# Vivado block design system, xczu9eg-ffvb1156-2-e, Vivado 2018.3
# (continued, part 2 of 3)
current_bd_instance /rx_fir_decimator

# ---- hierarchy /axi_adrv9009_rx_os_jesd ----
current_bd_instance /axi_adrv9009_rx_os_jesd
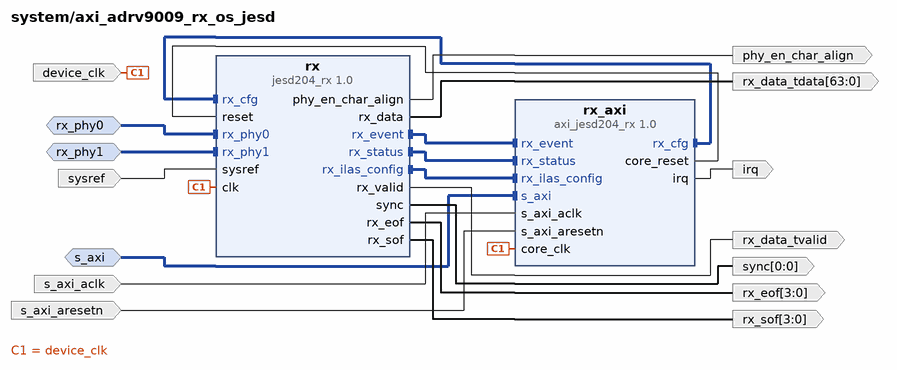
[diagram p11: block diagram inside /axi_adrv9009_rx_os_jesd]
create_bd_intf_pin -mode Slave -vlnv xilinx.com:interface:aximm_rtl:1.0 s_axi
create_bd_intf_pin -mode Slave -vlnv xilinx.com:display_jesd204:jesd204_rx_bus_rtl:1.0 rx_phy0
create_bd_intf_pin -mode Slave -vlnv xilinx.com:display_jesd204:jesd204_rx_bus_rtl:1.0 rx_phy1
create_bd_pin -dir I -type clk s_axi_aclk
create_bd_pin -dir I -type rst s_axi_aresetn
create_bd_pin -dir O -type intr irq
create_bd_pin -dir I -type clk device_clk
create_bd_pin -dir O -from 0 -to 0 sync
create_bd_pin -dir I sysref
create_bd_pin -dir O phy_en_char_align
create_bd_pin -dir O -from 3 -to 0 rx_eof
create_bd_pin -dir O -from 3 -to 0 rx_sof
create_bd_pin -dir O rx_data_tvalid
create_bd_pin -dir O -from 63 -to 0 rx_data_tdata

create_bd_cell -type ip -vlnv analog.com:user:axi_jesd204_rx:1.0 rx_axi
set_property -dict {CONFIG.NUM_LANES 2 CONFIG.NUM_LINKS 1} [get_bd_cells rx_axi]
create_bd_cell -type ip -vlnv analog.com:user:jesd204_rx:1.0 rx
set_property -dict {CONFIG.NUM_LANES 2 CONFIG.NUM_LINKS 1} [get_bd_cells rx]

# ---- hierarchy /rx_os_adrv9009_tpl_core ----
current_bd_instance /rx_os_adrv9009_tpl_core
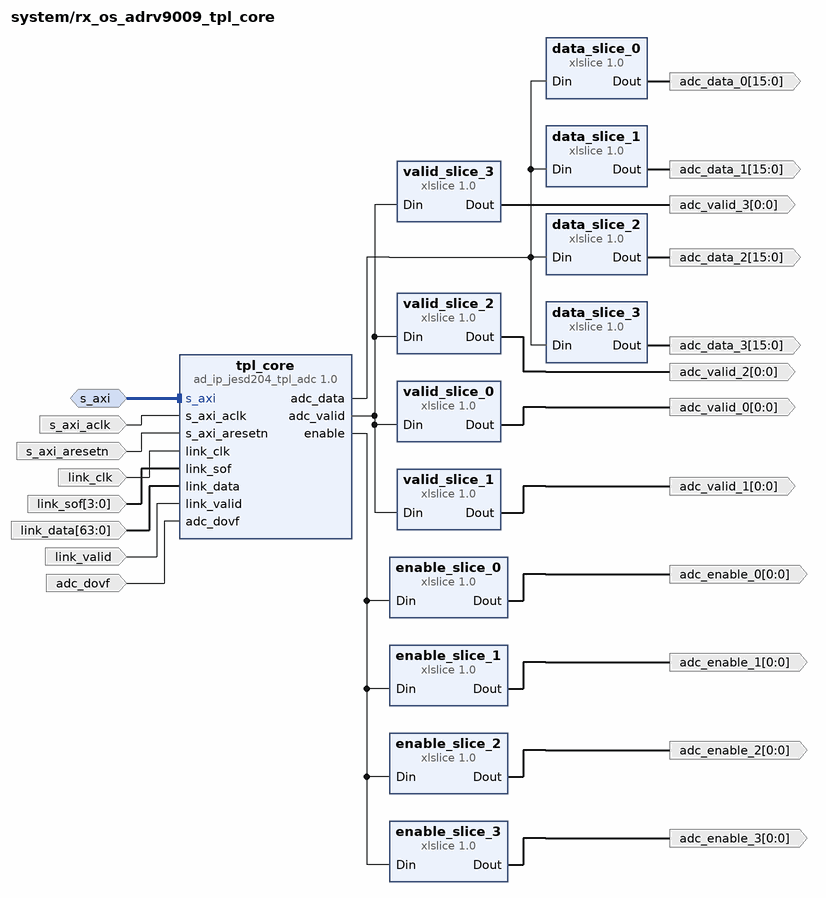
[diagram p12: block diagram inside /rx_os_adrv9009_tpl_core]
create_bd_intf_pin -mode Slave -vlnv xilinx.com:interface:aximm_rtl:1.0 s_axi
create_bd_pin -dir I -type clk s_axi_aclk
create_bd_pin -dir I -type rst s_axi_aresetn
create_bd_pin -dir I -type clk link_clk
create_bd_pin -dir I -from 3 -to 0 link_sof
create_bd_pin -dir I link_valid
create_bd_pin -dir I -from 63 -to 0 link_data
create_bd_pin -dir I adc_dovf
create_bd_pin -dir O -from 0 -to 0 adc_enable_0
create_bd_pin -dir O -from 0 -to 0 adc_valid_0
create_bd_pin -dir O -from 15 -to 0 adc_data_0
create_bd_pin -dir O -from 0 -to 0 adc_enable_1
create_bd_pin -dir O -from 0 -to 0 adc_valid_1
create_bd_pin -dir O -from 15 -to 0 adc_data_1
create_bd_pin -dir O -from 0 -to 0 adc_enable_2
create_bd_pin -dir O -from 0 -to 0 adc_valid_2
create_bd_pin -dir O -from 15 -to 0 adc_data_2
create_bd_pin -dir O -from 0 -to 0 adc_enable_3
create_bd_pin -dir O -from 0 -to 0 adc_valid_3
create_bd_pin -dir O -from 15 -to 0 adc_data_3

create_bd_cell -type ip -vlnv analog.com:user:ad_ip_jesd204_tpl_adc:1.0 tpl_core
set_property -dict [list \
  CONFIG.BITS_PER_SAMPLE 16 \
  CONFIG.CONVERTER_RESOLUTION 16 \
  CONFIG.NUM_CHANNELS 4 \
  CONFIG.NUM_LANES 2 \
  CONFIG.OCTETS_PER_BEAT 4 \
  CONFIG.SAMPLES_PER_FRAME 1 \
] [get_bd_cells tpl_core]
create_bd_cell -type ip -vlnv xilinx.com:ip:xlslice:1.0 data_slice_0
set_property -dict {CONFIG.DIN_FROM 15 CONFIG.DIN_TO 0 CONFIG.DIN_WIDTH 64} [get_bd_cells data_slice_0]
create_bd_cell -type ip -vlnv xilinx.com:ip:xlslice:1.0 enable_slice_0
set_property -dict {CONFIG.DIN_FROM 0 CONFIG.DIN_TO 0 CONFIG.DIN_WIDTH 4} [get_bd_cells enable_slice_0]
create_bd_cell -type ip -vlnv xilinx.com:ip:xlslice:1.0 valid_slice_0
set_property -dict {CONFIG.DIN_FROM 0 CONFIG.DIN_TO 0 CONFIG.DIN_WIDTH 4} [get_bd_cells valid_slice_0]
create_bd_cell -type ip -vlnv xilinx.com:ip:xlslice:1.0 data_slice_1
set_property -dict {CONFIG.DIN_FROM 31 CONFIG.DIN_TO 16 CONFIG.DIN_WIDTH 64} [get_bd_cells data_slice_1]
create_bd_cell -type ip -vlnv xilinx.com:ip:xlslice:1.0 enable_slice_1
set_property -dict {CONFIG.DIN_FROM 1 CONFIG.DIN_TO 1 CONFIG.DIN_WIDTH 4} [get_bd_cells enable_slice_1]
create_bd_cell -type ip -vlnv xilinx.com:ip:xlslice:1.0 valid_slice_1
set_property -dict {CONFIG.DIN_FROM 1 CONFIG.DIN_TO 1 CONFIG.DIN_WIDTH 4} [get_bd_cells valid_slice_1]
create_bd_cell -type ip -vlnv xilinx.com:ip:xlslice:1.0 data_slice_2
set_property -dict {CONFIG.DIN_FROM 47 CONFIG.DIN_TO 32 CONFIG.DIN_WIDTH 64} [get_bd_cells data_slice_2]
create_bd_cell -type ip -vlnv xilinx.com:ip:xlslice:1.0 enable_slice_2
set_property -dict {CONFIG.DIN_FROM 2 CONFIG.DIN_TO 2 CONFIG.DIN_WIDTH 4} [get_bd_cells enable_slice_2]
create_bd_cell -type ip -vlnv xilinx.com:ip:xlslice:1.0 valid_slice_2
set_property -dict {CONFIG.DIN_FROM 2 CONFIG.DIN_TO 2 CONFIG.DIN_WIDTH 4} [get_bd_cells valid_slice_2]
create_bd_cell -type ip -vlnv xilinx.com:ip:xlslice:1.0 data_slice_3
set_property -dict {CONFIG.DIN_FROM 63 CONFIG.DIN_TO 48 CONFIG.DIN_WIDTH 64} [get_bd_cells data_slice_3]
create_bd_cell -type ip -vlnv xilinx.com:ip:xlslice:1.0 enable_slice_3
set_property -dict {CONFIG.DIN_FROM 3 CONFIG.DIN_TO 3 CONFIG.DIN_WIDTH 4} [get_bd_cells enable_slice_3]
create_bd_cell -type ip -vlnv xilinx.com:ip:xlslice:1.0 valid_slice_3
set_property -dict {CONFIG.DIN_FROM 3 CONFIG.DIN_TO 3 CONFIG.DIN_WIDTH 4} [get_bd_cells valid_slice_3]

# ---- connections ----

current_bd_instance /axi_adrv9009_tx_jesd
connect_bd_intf_net [get_bd_intf_pins tx_phy2] [get_bd_intf_pins tx/tx_phy2]
connect_bd_intf_net [get_bd_intf_pins tx_phy0] [get_bd_intf_pins tx/tx_phy0]
connect_bd_intf_net [get_bd_intf_pins tx/tx_ilas_config] [get_bd_intf_pins tx_axi/tx_ilas_config]
connect_bd_intf_net [get_bd_intf_pins tx_phy3] [get_bd_intf_pins tx/tx_phy3]
connect_bd_intf_net [get_bd_intf_pins tx_axi/tx_cfg] [get_bd_intf_pins tx/tx_cfg]
connect_bd_intf_net [get_bd_intf_pins s_axi] [get_bd_intf_pins tx_axi/s_axi]
connect_bd_intf_net [get_bd_intf_pins tx_axi/tx_ctrl] [get_bd_intf_pins tx/tx_ctrl]
connect_bd_intf_net [get_bd_intf_pins tx_data] [get_bd_intf_pins tx/tx_data]
connect_bd_intf_net [get_bd_intf_pins tx/tx_status] [get_bd_intf_pins tx_axi/tx_status]
connect_bd_intf_net [get_bd_intf_pins tx_phy1] [get_bd_intf_pins tx/tx_phy1]
connect_bd_intf_net [get_bd_intf_pins tx/tx_event] [get_bd_intf_pins tx_axi/tx_event]
connect_bd_net [get_bd_pins tx_axi/core_reset] [get_bd_pins tx/reset]
connect_bd_net [get_bd_pins s_axi_aclk] [get_bd_pins tx_axi/s_axi_aclk]
connect_bd_net [get_bd_pins s_axi_aresetn] [get_bd_pins tx_axi/s_axi_aresetn]
connect_bd_net [get_bd_pins tx_axi/irq] [get_bd_pins irq]
connect_bd_net [get_bd_pins device_clk] [get_bd_pins tx_axi/core_clk] [get_bd_pins tx/clk]
connect_bd_net [get_bd_pins sync] [get_bd_pins tx/sync]
connect_bd_net [get_bd_pins sysref] [get_bd_pins tx/sysref]

current_bd_instance /tx_fir_interpolator
connect_bd_net [get_bd_pins aclk] \
  [get_bd_pins cdc_sync_active/out_clk] [get_bd_pins rate_gen/clk] [get_bd_pins fir_interpolation_0/aclk] \
  [get_bd_pins fir_interpolation_1/aclk] [get_bd_pins fir_interpolation_2/aclk] [get_bd_pins fir_interpolation_3/aclk]
connect_bd_net [get_bd_pins out_resetn] [get_bd_pins cdc_sync_active/out_resetn]
connect_bd_net [get_bd_pins active] [get_bd_pins cdc_sync_active/in_bits]
connect_bd_net [get_bd_pins pulse_width] [get_bd_pins rate_gen/pulse_width] [get_bd_pins rate_gen/pulse_period]
connect_bd_net [get_bd_pins load_config] [get_bd_pins rate_gen/load_config]
connect_bd_net [get_bd_pins cdc_sync_active/out_bits] \
  [get_bd_pins rate_gen/rstn] [get_bd_pins out_mux_0/select_path] [get_bd_pins out_mux_1/select_path] \
  [get_bd_pins out_mux_2/select_path] [get_bd_pins out_mux_3/select_path]
connect_bd_net [get_bd_pins rate_gen/pulse] \
  [get_bd_pins logic_and_0/Op1] [get_bd_pins out_mux_0/valid_in_1] [get_bd_pins logic_and_1/Op1] \
  [get_bd_pins out_mux_1/valid_in_1] [get_bd_pins logic_and_2/Op1] [get_bd_pins out_mux_2/valid_in_1] \
  [get_bd_pins logic_and_3/Op1] [get_bd_pins out_mux_3/valid_in_1]
connect_bd_net -net dac_valid_0_1 [get_bd_pins dac_valid_0] [get_bd_pins logic_and_0/Op2] [get_bd_pins out_mux_0/valid_in_0]
connect_bd_net [get_bd_pins logic_and_0/Res] [get_bd_pins fir_interpolation_0/s_axis_data_tvalid]
connect_bd_net -net data_in_0_1 [get_bd_pins data_in_0] [get_bd_pins fir_interpolation_0/s_axis_data_tdata] [get_bd_pins out_mux_0/data_in_0]
connect_bd_net -net dac_enable_0_1 [get_bd_pins dac_enable_0] [get_bd_pins out_mux_0/enable_in_1] [get_bd_pins out_mux_0/enable_in_0]
connect_bd_net [get_bd_pins fir_interpolation_0/m_axis_data_tdata] [get_bd_pins out_mux_0/data_in_1]
connect_bd_net [get_bd_pins out_mux_0/valid_out] [get_bd_pins valid_out_0]
connect_bd_net [get_bd_pins out_mux_0/enable_out] [get_bd_pins enable_out_0]
connect_bd_net [get_bd_pins out_mux_0/data_out] [get_bd_pins data_out_0]
connect_bd_net -net dac_valid_1_1 [get_bd_pins dac_valid_1] [get_bd_pins logic_and_1/Op2] [get_bd_pins out_mux_1/valid_in_0]
connect_bd_net [get_bd_pins logic_and_1/Res] [get_bd_pins fir_interpolation_1/s_axis_data_tvalid]
connect_bd_net -net data_in_1_1 [get_bd_pins data_in_1] [get_bd_pins fir_interpolation_1/s_axis_data_tdata] [get_bd_pins out_mux_1/data_in_0]
connect_bd_net -net dac_enable_1_1 [get_bd_pins dac_enable_1] [get_bd_pins out_mux_1/enable_in_1] [get_bd_pins out_mux_1/enable_in_0]
connect_bd_net [get_bd_pins fir_interpolation_1/m_axis_data_tdata] [get_bd_pins out_mux_1/data_in_1]
connect_bd_net [get_bd_pins out_mux_1/valid_out] [get_bd_pins valid_out_1]
connect_bd_net [get_bd_pins out_mux_1/enable_out] [get_bd_pins enable_out_1]
connect_bd_net [get_bd_pins out_mux_1/data_out] [get_bd_pins data_out_1]
connect_bd_net -net dac_valid_2_1 [get_bd_pins dac_valid_2] [get_bd_pins logic_and_2/Op2] [get_bd_pins out_mux_2/valid_in_0]
connect_bd_net [get_bd_pins logic_and_2/Res] [get_bd_pins fir_interpolation_2/s_axis_data_tvalid]
connect_bd_net -net data_in_2_1 [get_bd_pins data_in_2] [get_bd_pins fir_interpolation_2/s_axis_data_tdata] [get_bd_pins out_mux_2/data_in_0]
connect_bd_net -net dac_enable_2_1 [get_bd_pins dac_enable_2] [get_bd_pins out_mux_2/enable_in_1] [get_bd_pins out_mux_2/enable_in_0]
connect_bd_net [get_bd_pins fir_interpolation_2/m_axis_data_tdata] [get_bd_pins out_mux_2/data_in_1]
connect_bd_net [get_bd_pins out_mux_2/valid_out] [get_bd_pins valid_out_2]
connect_bd_net [get_bd_pins out_mux_2/enable_out] [get_bd_pins enable_out_2]
connect_bd_net [get_bd_pins out_mux_2/data_out] [get_bd_pins data_out_2]
connect_bd_net -net dac_valid_3_1 [get_bd_pins dac_valid_3] [get_bd_pins logic_and_3/Op2] [get_bd_pins out_mux_3/valid_in_0]
connect_bd_net [get_bd_pins logic_and_3/Res] [get_bd_pins fir_interpolation_3/s_axis_data_tvalid]
connect_bd_net -net data_in_3_1 [get_bd_pins data_in_3] [get_bd_pins fir_interpolation_3/s_axis_data_tdata] [get_bd_pins out_mux_3/data_in_0]
connect_bd_net -net dac_enable_3_1 [get_bd_pins dac_enable_3] [get_bd_pins out_mux_3/enable_in_1] [get_bd_pins out_mux_3/enable_in_0]
connect_bd_net [get_bd_pins fir_interpolation_3/m_axis_data_tdata] [get_bd_pins out_mux_3/data_in_1]
connect_bd_net [get_bd_pins out_mux_3/valid_out] [get_bd_pins valid_out_3]
connect_bd_net [get_bd_pins out_mux_3/enable_out] [get_bd_pins enable_out_3]
connect_bd_net [get_bd_pins out_mux_3/data_out] [get_bd_pins data_out_3]

current_bd_instance /tx_adrv9009_tpl_core
connect_bd_intf_net [get_bd_intf_pins s_axi] [get_bd_intf_pins tpl_core/s_axi]
connect_bd_intf_net [get_bd_intf_pins link] [get_bd_intf_pins tpl_core/link]
connect_bd_net [get_bd_pins s_axi_aclk] [get_bd_pins tpl_core/s_axi_aclk]
connect_bd_net [get_bd_pins s_axi_aresetn] [get_bd_pins tpl_core/s_axi_aresetn]
connect_bd_net [get_bd_pins link_clk] [get_bd_pins tpl_core/link_clk]
connect_bd_net [get_bd_pins tpl_core/enable] \
  [get_bd_pins enable_slice_0/Din] [get_bd_pins enable_slice_1/Din] [get_bd_pins enable_slice_2/Din] \
  [get_bd_pins enable_slice_3/Din]
connect_bd_net [get_bd_pins tpl_core/dac_valid] \
  [get_bd_pins valid_slice_0/Din] [get_bd_pins valid_slice_1/Din] [get_bd_pins valid_slice_2/Din] \
  [get_bd_pins valid_slice_3/Din]
connect_bd_net [get_bd_pins enable_slice_0/Dout] [get_bd_pins dac_enable_0]
connect_bd_net [get_bd_pins valid_slice_0/Dout] [get_bd_pins dac_valid_0]
connect_bd_net -net dac_data_0_1 [get_bd_pins dac_data_0] [get_bd_pins data_concat/In0]
connect_bd_net [get_bd_pins enable_slice_1/Dout] [get_bd_pins dac_enable_1]
connect_bd_net [get_bd_pins valid_slice_1/Dout] [get_bd_pins dac_valid_1]
connect_bd_net -net dac_data_1_1 [get_bd_pins dac_data_1] [get_bd_pins data_concat/In1]
connect_bd_net [get_bd_pins enable_slice_2/Dout] [get_bd_pins dac_enable_2]
connect_bd_net [get_bd_pins valid_slice_2/Dout] [get_bd_pins dac_valid_2]
connect_bd_net -net dac_data_2_1 [get_bd_pins dac_data_2] [get_bd_pins data_concat/In2]
connect_bd_net [get_bd_pins enable_slice_3/Dout] [get_bd_pins dac_enable_3]
connect_bd_net [get_bd_pins valid_slice_3/Dout] [get_bd_pins dac_valid_3]
connect_bd_net -net dac_data_3_1 [get_bd_pins dac_data_3] [get_bd_pins data_concat/In3]
connect_bd_net [get_bd_pins data_concat/dout] [get_bd_pins tpl_core/dac_ddata]
connect_bd_net [get_bd_pins dac_dunf] [get_bd_pins tpl_core/dac_dunf]

current_bd_instance /axi_adrv9009_rx_jesd
connect_bd_intf_net [get_bd_intf_pins rx_phy0] [get_bd_intf_pins rx/rx_phy0]
connect_bd_intf_net [get_bd_intf_pins rx/rx_ilas_config] [get_bd_intf_pins rx_axi/rx_ilas_config]
connect_bd_intf_net [get_bd_intf_pins rx/rx_status] [get_bd_intf_pins rx_axi/rx_status]
connect_bd_intf_net [get_bd_intf_pins s_axi] [get_bd_intf_pins rx_axi/s_axi]
connect_bd_intf_net [get_bd_intf_pins rx/rx_event] [get_bd_intf_pins rx_axi/rx_event]
connect_bd_intf_net [get_bd_intf_pins rx_axi/rx_cfg] [get_bd_intf_pins rx/rx_cfg]
connect_bd_intf_net [get_bd_intf_pins rx_phy1] [get_bd_intf_pins rx/rx_phy1]
connect_bd_net [get_bd_pins rx_axi/core_reset] [get_bd_pins rx/reset]
connect_bd_net [get_bd_pins s_axi_aclk] [get_bd_pins rx_axi/s_axi_aclk]
connect_bd_net [get_bd_pins s_axi_aresetn] [get_bd_pins rx_axi/s_axi_aresetn]
connect_bd_net [get_bd_pins rx_axi/irq] [get_bd_pins irq]
connect_bd_net [get_bd_pins device_clk] [get_bd_pins rx_axi/core_clk] [get_bd_pins rx/clk]
connect_bd_net [get_bd_pins rx/sync] [get_bd_pins sync]
connect_bd_net [get_bd_pins sysref] [get_bd_pins rx/sysref]
connect_bd_net [get_bd_pins rx/phy_en_char_align] [get_bd_pins phy_en_char_align]
connect_bd_net [get_bd_pins rx/rx_data] [get_bd_pins rx_data_tdata]
connect_bd_net [get_bd_pins rx/rx_valid] [get_bd_pins rx_data_tvalid]
connect_bd_net [get_bd_pins rx/rx_eof] [get_bd_pins rx_eof]
connect_bd_net [get_bd_pins rx/rx_sof] [get_bd_pins rx_sof]

current_bd_instance /rx_adrv9009_tpl_core
connect_bd_intf_net [get_bd_intf_pins s_axi] [get_bd_intf_pins tpl_core/s_axi]
connect_bd_net [get_bd_pins s_axi_aclk] [get_bd_pins tpl_core/s_axi_aclk]
connect_bd_net [get_bd_pins s_axi_aresetn] [get_bd_pins tpl_core/s_axi_aresetn]
connect_bd_net [get_bd_pins link_clk] [get_bd_pins tpl_core/link_clk]
connect_bd_net [get_bd_pins link_sof] [get_bd_pins tpl_core/link_sof]
connect_bd_net [get_bd_pins link_data] [get_bd_pins tpl_core/link_data]
connect_bd_net [get_bd_pins link_valid] [get_bd_pins tpl_core/link_valid]
connect_bd_net [get_bd_pins tpl_core/adc_data] \
  [get_bd_pins data_slice_0/Din] [get_bd_pins data_slice_1/Din] [get_bd_pins data_slice_2/Din] [get_bd_pins data_slice_3/Din]
connect_bd_net [get_bd_pins tpl_core/enable] \
  [get_bd_pins enable_slice_0/Din] [get_bd_pins enable_slice_1/Din] [get_bd_pins enable_slice_2/Din] \
  [get_bd_pins enable_slice_3/Din]
connect_bd_net [get_bd_pins tpl_core/adc_valid] \
  [get_bd_pins valid_slice_0/Din] [get_bd_pins valid_slice_1/Din] [get_bd_pins valid_slice_2/Din] \
  [get_bd_pins valid_slice_3/Din]
connect_bd_net [get_bd_pins data_slice_0/Dout] [get_bd_pins adc_data_0]
connect_bd_net [get_bd_pins enable_slice_0/Dout] [get_bd_pins adc_enable_0]
connect_bd_net [get_bd_pins valid_slice_0/Dout] [get_bd_pins adc_valid_0]
connect_bd_net [get_bd_pins data_slice_1/Dout] [get_bd_pins adc_data_1]
connect_bd_net [get_bd_pins enable_slice_1/Dout] [get_bd_pins adc_enable_1]
connect_bd_net [get_bd_pins valid_slice_1/Dout] [get_bd_pins adc_valid_1]
connect_bd_net [get_bd_pins data_slice_2/Dout] [get_bd_pins adc_data_2]
connect_bd_net [get_bd_pins enable_slice_2/Dout] [get_bd_pins adc_enable_2]
connect_bd_net [get_bd_pins valid_slice_2/Dout] [get_bd_pins adc_valid_2]
connect_bd_net [get_bd_pins data_slice_3/Dout] [get_bd_pins adc_data_3]
connect_bd_net [get_bd_pins enable_slice_3/Dout] [get_bd_pins adc_enable_3]
connect_bd_net [get_bd_pins valid_slice_3/Dout] [get_bd_pins adc_valid_3]
connect_bd_net [get_bd_pins adc_dovf] [get_bd_pins tpl_core/adc_dovf]

current_bd_instance /rx_fir_decimator
connect_bd_net [get_bd_pins aclk] \
  [get_bd_pins cdc_sync_active/out_clk] [get_bd_pins fir_decimation_0/aclk] [get_bd_pins fir_decimation_1/aclk] \
  [get_bd_pins fir_decimation_2/aclk] [get_bd_pins fir_decimation_3/aclk]
connect_bd_net [get_bd_pins out_resetn] [get_bd_pins cdc_sync_active/out_resetn]
connect_bd_net [get_bd_pins active] [get_bd_pins cdc_sync_active/in_bits]
connect_bd_net -net valid_in_0_1 [get_bd_pins valid_in_0] [get_bd_pins out_mux_0/valid_in_0] [get_bd_pins fir_decimation_0/s_axis_data_tvalid]
connect_bd_net -net enable_in_0_1 [get_bd_pins enable_in_0] [get_bd_pins out_mux_0/enable_in_0] [get_bd_pins out_mux_0/enable_in_1]
connect_bd_net -net data_in_0_1 [get_bd_pins data_in_0] [get_bd_pins out_mux_0/data_in_0] [get_bd_pins fir_decimation_0/s_axis_data_tdata]
connect_bd_net [get_bd_pins fir_decimation_0/m_axis_data_tvalid] [get_bd_pins out_mux_0/valid_in_1]
connect_bd_net [get_bd_pins fir_decimation_0/m_axis_data_tdata] [get_bd_pins out_mux_0/data_in_1]
connect_bd_net [get_bd_pins out_mux_0/valid_out] [get_bd_pins valid_out_0]
connect_bd_net [get_bd_pins out_mux_0/enable_out] [get_bd_pins enable_out_0]
connect_bd_net [get_bd_pins out_mux_0/data_out] [get_bd_pins data_out_0]
connect_bd_net [get_bd_pins cdc_sync_active/out_bits] \
  [get_bd_pins out_mux_0/select_path] [get_bd_pins out_mux_1/select_path] [get_bd_pins out_mux_2/select_path] \
  [get_bd_pins out_mux_3/select_path]
connect_bd_net -net valid_in_1_1 [get_bd_pins valid_in_1] [get_bd_pins out_mux_1/valid_in_0] [get_bd_pins fir_decimation_1/s_axis_data_tvalid]
connect_bd_net -net enable_in_1_1 [get_bd_pins enable_in_1] [get_bd_pins out_mux_1/enable_in_0] [get_bd_pins out_mux_1/enable_in_1]
connect_bd_net -net data_in_1_1 [get_bd_pins data_in_1] [get_bd_pins out_mux_1/data_in_0] [get_bd_pins fir_decimation_1/s_axis_data_tdata]
connect_bd_net [get_bd_pins fir_decimation_1/m_axis_data_tvalid] [get_bd_pins out_mux_1/valid_in_1]
connect_bd_net [get_bd_pins fir_decimation_1/m_axis_data_tdata] [get_bd_pins out_mux_1/data_in_1]
connect_bd_net [get_bd_pins out_mux_1/valid_out] [get_bd_pins valid_out_1]
connect_bd_net [get_bd_pins out_mux_1/enable_out] [get_bd_pins enable_out_1]
connect_bd_net [get_bd_pins out_mux_1/data_out] [get_bd_pins data_out_1]
connect_bd_net -net valid_in_2_1 [get_bd_pins valid_in_2] [get_bd_pins out_mux_2/valid_in_0] [get_bd_pins fir_decimation_2/s_axis_data_tvalid]
connect_bd_net -net enable_in_2_1 [get_bd_pins enable_in_2] [get_bd_pins out_mux_2/enable_in_0] [get_bd_pins out_mux_2/enable_in_1]
connect_bd_net -net data_in_2_1 [get_bd_pins data_in_2] [get_bd_pins out_mux_2/data_in_0] [get_bd_pins fir_decimation_2/s_axis_data_tdata]
connect_bd_net [get_bd_pins fir_decimation_2/m_axis_data_tvalid] [get_bd_pins out_mux_2/valid_in_1]
connect_bd_net [get_bd_pins fir_decimation_2/m_axis_data_tdata] [get_bd_pins out_mux_2/data_in_1]
connect_bd_net [get_bd_pins out_mux_2/valid_out] [get_bd_pins valid_out_2]
connect_bd_net [get_bd_pins out_mux_2/enable_out] [get_bd_pins enable_out_2]
connect_bd_net [get_bd_pins out_mux_2/data_out] [get_bd_pins data_out_2]
connect_bd_net -net valid_in_3_1 [get_bd_pins valid_in_3] [get_bd_pins out_mux_3/valid_in_0] [get_bd_pins fir_decimation_3/s_axis_data_tvalid]
connect_bd_net -net enable_in_3_1 [get_bd_pins enable_in_3] [get_bd_pins out_mux_3/enable_in_0] [get_bd_pins out_mux_3/enable_in_1]
connect_bd_net -net data_in_3_1 [get_bd_pins data_in_3] [get_bd_pins out_mux_3/data_in_0] [get_bd_pins fir_decimation_3/s_axis_data_tdata]
connect_bd_net [get_bd_pins fir_decimation_3/m_axis_data_tvalid] [get_bd_pins out_mux_3/valid_in_1]
connect_bd_net [get_bd_pins fir_decimation_3/m_axis_data_tdata] [get_bd_pins out_mux_3/data_in_1]
connect_bd_net [get_bd_pins out_mux_3/valid_out] [get_bd_pins valid_out_3]
connect_bd_net [get_bd_pins out_mux_3/enable_out] [get_bd_pins enable_out_3]
connect_bd_net [get_bd_pins out_mux_3/data_out] [get_bd_pins data_out_3]

current_bd_instance /axi_adrv9009_rx_os_jesd
connect_bd_intf_net [get_bd_intf_pins s_axi] [get_bd_intf_pins rx_axi/s_axi]
connect_bd_intf_net [get_bd_intf_pins rx/rx_event] [get_bd_intf_pins rx_axi/rx_event]
connect_bd_intf_net [get_bd_intf_pins rx_phy0] [get_bd_intf_pins rx/rx_phy0]
connect_bd_intf_net [get_bd_intf_pins rx_phy1] [get_bd_intf_pins rx/rx_phy1]
connect_bd_intf_net [get_bd_intf_pins rx_axi/rx_cfg] [get_bd_intf_pins rx/rx_cfg]
connect_bd_intf_net [get_bd_intf_pins rx/rx_status] [get_bd_intf_pins rx_axi/rx_status]
connect_bd_intf_net [get_bd_intf_pins rx/rx_ilas_config] [get_bd_intf_pins rx_axi/rx_ilas_config]
connect_bd_net [get_bd_pins rx_axi/core_reset] [get_bd_pins rx/reset]
connect_bd_net [get_bd_pins s_axi_aclk] [get_bd_pins rx_axi/s_axi_aclk]
connect_bd_net [get_bd_pins s_axi_aresetn] [get_bd_pins rx_axi/s_axi_aresetn]
connect_bd_net [get_bd_pins rx_axi/irq] [get_bd_pins irq]
connect_bd_net [get_bd_pins device_clk] [get_bd_pins rx_axi/core_clk] [get_bd_pins rx/clk]
connect_bd_net [get_bd_pins rx/sync] [get_bd_pins sync]
connect_bd_net [get_bd_pins sysref] [get_bd_pins rx/sysref]
connect_bd_net [get_bd_pins rx/phy_en_char_align] [get_bd_pins phy_en_char_align]
connect_bd_net [get_bd_pins rx/rx_data] [get_bd_pins rx_data_tdata]
connect_bd_net [get_bd_pins rx/rx_valid] [get_bd_pins rx_data_tvalid]
connect_bd_net [get_bd_pins rx/rx_eof] [get_bd_pins rx_eof]
connect_bd_net [get_bd_pins rx/rx_sof] [get_bd_pins rx_sof]

current_bd_instance /rx_os_adrv9009_tpl_core
connect_bd_intf_net [get_bd_intf_pins s_axi] [get_bd_intf_pins tpl_core/s_axi]
connect_bd_net [get_bd_pins s_axi_aclk] [get_bd_pins tpl_core/s_axi_aclk]
connect_bd_net [get_bd_pins s_axi_aresetn] [get_bd_pins tpl_core/s_axi_aresetn]
connect_bd_net [get_bd_pins link_clk] [get_bd_pins tpl_core/link_clk]
connect_bd_net [get_bd_pins link_sof] [get_bd_pins tpl_core/link_sof]
connect_bd_net [get_bd_pins link_data] [get_bd_pins tpl_core/link_data]
connect_bd_net [get_bd_pins link_valid] [get_bd_pins tpl_core/link_valid]
connect_bd_net [get_bd_pins tpl_core/adc_data] \
  [get_bd_pins data_slice_0/Din] [get_bd_pins data_slice_1/Din] [get_bd_pins data_slice_2/Din] [get_bd_pins data_slice_3/Din]
connect_bd_net [get_bd_pins tpl_core/enable] \
  [get_bd_pins enable_slice_0/Din] [get_bd_pins enable_slice_1/Din] [get_bd_pins enable_slice_2/Din] \
  [get_bd_pins enable_slice_3/Din]
connect_bd_net [get_bd_pins tpl_core/adc_valid] \
  [get_bd_pins valid_slice_0/Din] [get_bd_pins valid_slice_1/Din] [get_bd_pins valid_slice_2/Din] \
  [get_bd_pins valid_slice_3/Din]
connect_bd_net [get_bd_pins data_slice_0/Dout] [get_bd_pins adc_data_0]
connect_bd_net [get_bd_pins enable_slice_0/Dout] [get_bd_pins adc_enable_0]
connect_bd_net [get_bd_pins valid_slice_0/Dout] [get_bd_pins adc_valid_0]
connect_bd_net [get_bd_pins data_slice_1/Dout] [get_bd_pins adc_data_1]
connect_bd_net [get_bd_pins enable_slice_1/Dout] [get_bd_pins adc_enable_1]
connect_bd_net [get_bd_pins valid_slice_1/Dout] [get_bd_pins adc_valid_1]
connect_bd_net [get_bd_pins data_slice_2/Dout] [get_bd_pins adc_data_2]
connect_bd_net [get_bd_pins enable_slice_2/Dout] [get_bd_pins adc_enable_2]
connect_bd_net [get_bd_pins valid_slice_2/Dout] [get_bd_pins adc_valid_2]
connect_bd_net [get_bd_pins data_slice_3/Dout] [get_bd_pins adc_data_3]
connect_bd_net [get_bd_pins enable_slice_3/Dout] [get_bd_pins adc_enable_3]
connect_bd_net [get_bd_pins valid_slice_3/Dout] [get_bd_pins adc_valid_3]
connect_bd_net [get_bd_pins adc_dovf] [get_bd_pins tpl_core/adc_dovf]

current_bd_instance /
connect_bd_intf_net [get_bd_intf_ports axi_drp] [get_bd_intf_pins axi_interconnect_0/M03_AXI]
connect_bd_intf_net [get_bd_intf_pins jtag_axi_0/M_AXI] [get_bd_intf_pins axi_interconnect_0/S01_AXI]
connect_bd_intf_net [get_bd_intf_pins util_adrv9009_xcvr/tx_2] [get_bd_intf_pins axi_adrv9009_tx_jesd/tx_phy2]
connect_bd_intf_net [get_bd_intf_pins axi_cpu_interconnect/S00_AXI] [get_bd_intf_pins sys_ps8/M_AXI_HPM0_LPD]
connect_bd_intf_net [get_bd_intf_pins axi_adrv9009_tx_xcvr/up_ch_1] [get_bd_intf_pins util_adrv9009_xcvr/up_tx_3]
connect_bd_intf_net [get_bd_intf_pins axi_cpu_interconnect/M05_AXI] [get_bd_intf_pins axi_adrv9009_tx_clkgen/s_axi]
connect_bd_intf_net [get_bd_intf_pins axi_adrv9009_tx_xcvr/up_cm_0] [get_bd_intf_pins util_adrv9009_xcvr/up_cm_0]
connect_bd_intf_net [get_bd_intf_pins axi_cpu_interconnect/M15_AXI] [get_bd_intf_pins axi_adrv9009_rx_os_dma/s_axi]
connect_bd_intf_net [get_bd_intf_pins axi_cpu_interconnect/M10_AXI] [get_bd_intf_pins axi_adrv9009_rx_jesd/s_axi]
connect_bd_intf_net [get_bd_intf_pins axi_cpu_interconnect/M09_AXI] [get_bd_intf_pins axi_adrv9009_rx_clkgen/s_axi]
connect_bd_intf_net [get_bd_intf_pins util_adrv9009_xcvr/tx_3] [get_bd_intf_pins axi_adrv9009_tx_jesd/tx_phy1]
connect_bd_intf_net [get_bd_intf_ports axi_rx_bram] [get_bd_intf_pins axi_interconnect_0/M02_AXI]
connect_bd_intf_net [get_bd_intf_pins util_adrv9009_xcvr/rx_0] [get_bd_intf_pins axi_adrv9009_rx_jesd/rx_phy0]
connect_bd_intf_net [get_bd_intf_pins axi_hp3_interconnect/M00_AXI] [get_bd_intf_pins sys_ps8/S_AXI_HP3_FPD]
connect_bd_intf_net [get_bd_intf_ports axi_regs] [get_bd_intf_pins axi_interconnect_0/M00_AXI]
connect_bd_intf_net [get_bd_intf_pins util_adrv9009_xcvr/rx_3] [get_bd_intf_pins axi_adrv9009_rx_os_jesd/rx_phy1]
connect_bd_intf_net [get_bd_intf_pins axi_adrv9009_rx_os_xcvr/up_es_1] [get_bd_intf_pins util_adrv9009_xcvr/up_es_3]
connect_bd_intf_net [get_bd_intf_pins axi_cpu_interconnect/M12_AXI] [get_bd_intf_pins axi_adrv9009_rx_os_xcvr/s_axi]
connect_bd_intf_net [get_bd_intf_pins util_adrv9009_rx_cpack/packed_fifo_wr] [get_bd_intf_pins axi_adrv9009_rx_dma/fifo_wr]
connect_bd_intf_net [get_bd_intf_pins axi_hp0_interconnect/M00_AXI] [get_bd_intf_pins sys_ps8/S_AXI_HP0_FPD]
connect_bd_intf_net [get_bd_intf_pins axi_hp1_interconnect/M00_AXI] [get_bd_intf_pins sys_ps8/S_AXI_HP1_FPD]
connect_bd_intf_net [get_bd_intf_pins axi_adrv9009_tx_xcvr/up_ch_3] [get_bd_intf_pins util_adrv9009_xcvr/up_tx_1]
connect_bd_intf_net [get_bd_intf_ports axi_tx_bram] [get_bd_intf_pins axi_interconnect_0/M01_AXI]
connect_bd_intf_net [get_bd_intf_pins util_adrv9009_xcvr/rx_2] [get_bd_intf_pins axi_adrv9009_rx_os_jesd/rx_phy0]
connect_bd_intf_net [get_bd_intf_pins util_adrv9009_xcvr/tx_0] [get_bd_intf_pins axi_adrv9009_tx_jesd/tx_phy0]
connect_bd_intf_net [get_bd_intf_pins axi_adrv9009_rx_xcvr/up_es_1] [get_bd_intf_pins util_adrv9009_xcvr/up_es_1]
connect_bd_intf_net [get_bd_intf_pins axi_hp2_interconnect/S00_AXI] [get_bd_intf_pins axi_adrv9009_rx_dma/m_dest_axi]
connect_bd_intf_net [get_bd_intf_pins axi_cpu_interconnect/M08_AXI] [get_bd_intf_pins axi_adrv9009_rx_xcvr/s_axi]
connect_bd_intf_net [get_bd_intf_pins axi_hp2_interconnect/M00_AXI] [get_bd_intf_pins sys_ps8/S_AXI_HP2_FPD]
connect_bd_intf_net [get_bd_intf_pins axi_hp3_interconnect/S00_AXI] [get_bd_intf_pins axi_adrv9009_tx_dma/m_src_axi]
connect_bd_intf_net [get_bd_intf_pins axi_adrv9009_rx_xcvr/up_ch_1] [get_bd_intf_pins util_adrv9009_xcvr/up_rx_1]
connect_bd_intf_net [get_bd_intf_pins axi_cpu_interconnect/M00_AXI] [get_bd_intf_pins axi_sysid_0/s_axi]
connect_bd_intf_net [get_bd_intf_pins axi_cpu_interconnect/M16_AXI] [get_bd_intf_pins axi_interconnect_0/S00_AXI]
connect_bd_intf_net [get_bd_intf_pins axi_cpu_interconnect/M11_AXI] [get_bd_intf_pins axi_adrv9009_rx_dma/s_axi]
connect_bd_intf_net [get_bd_intf_pins axi_adrv9009_rx_os_xcvr/up_es_0] [get_bd_intf_pins util_adrv9009_xcvr/up_es_2]
connect_bd_intf_net [get_bd_intf_pins axi_adrv9009_rx_xcvr/up_es_0] [get_bd_intf_pins util_adrv9009_xcvr/up_es_0]
connect_bd_intf_net [get_bd_intf_pins axi_adrv9009_tx_xcvr/up_ch_2] [get_bd_intf_pins util_adrv9009_xcvr/up_tx_2]
connect_bd_intf_net [get_bd_intf_pins axi_adrv9009_tx_jesd/tx_data] [get_bd_intf_pins tx_adrv9009_tpl_core/link]
connect_bd_intf_net [get_bd_intf_pins axi_hp0_interconnect/S00_AXI] [get_bd_intf_pins axi_adrv9009_rx_xcvr/m_axi]
connect_bd_intf_net [get_bd_intf_pins axi_cpu_interconnect/M06_AXI] [get_bd_intf_pins axi_adrv9009_tx_jesd/s_axi]
connect_bd_intf_net [get_bd_intf_pins axi_adrv9009_rx_xcvr/up_ch_0] [get_bd_intf_pins util_adrv9009_xcvr/up_rx_0]
connect_bd_intf_net [get_bd_intf_pins axi_adrv9009_tx_xcvr/up_ch_0] [get_bd_intf_pins util_adrv9009_xcvr/up_tx_0]
connect_bd_intf_net [get_bd_intf_pins util_adrv9009_xcvr/rx_1] [get_bd_intf_pins axi_adrv9009_rx_jesd/rx_phy1]
connect_bd_intf_net [get_bd_intf_pins axi_hp0_interconnect/S01_AXI] [get_bd_intf_pins axi_adrv9009_rx_os_xcvr/m_axi]
connect_bd_intf_net [get_bd_intf_pins axi_adrv9009_rx_os_xcvr/up_ch_1] [get_bd_intf_pins util_adrv9009_xcvr/up_rx_3]
connect_bd_intf_net [get_bd_intf_pins axi_cpu_interconnect/M07_AXI] [get_bd_intf_pins axi_adrv9009_tx_dma/s_axi]
connect_bd_intf_net [get_bd_intf_pins axi_cpu_interconnect/M02_AXI] [get_bd_intf_pins tx_adrv9009_tpl_core/s_axi]
connect_bd_intf_net [get_bd_intf_pins axi_cpu_interconnect/M04_AXI] [get_bd_intf_pins axi_adrv9009_tx_xcvr/s_axi]
connect_bd_intf_net [get_bd_intf_pins axi_cpu_interconnect/M13_AXI] [get_bd_intf_pins axi_adrv9009_rx_os_clkgen/s_axi]
connect_bd_intf_net [get_bd_intf_pins axi_hp1_interconnect/S00_AXI] [get_bd_intf_pins axi_adrv9009_rx_os_dma/m_dest_axi]
connect_bd_intf_net [get_bd_intf_pins axi_cpu_interconnect/M01_AXI] [get_bd_intf_pins rx_adrv9009_tpl_core/s_axi]
connect_bd_intf_net [get_bd_intf_pins axi_cpu_interconnect/M03_AXI] [get_bd_intf_pins rx_os_adrv9009_tpl_core/s_axi]
connect_bd_intf_net [get_bd_intf_pins axi_adrv9009_rx_os_xcvr/up_ch_0] [get_bd_intf_pins util_adrv9009_xcvr/up_rx_2]
connect_bd_intf_net [get_bd_intf_pins util_adrv9009_rx_os_cpack/packed_fifo_wr] [get_bd_intf_pins axi_adrv9009_rx_os_dma/fifo_wr]
connect_bd_intf_net [get_bd_intf_pins axi_cpu_interconnect/M14_AXI] [get_bd_intf_pins axi_adrv9009_rx_os_jesd/s_axi]
connect_bd_intf_net [get_bd_intf_pins util_adrv9009_xcvr/tx_1] [get_bd_intf_pins axi_adrv9009_tx_jesd/tx_phy3]
connect_bd_net -net sys_cpu_clk [get_bd_pins sys_ps8/pl_clk0] \
  [get_bd_pins sys_rstgen/slowest_sync_clk] [get_bd_pins rom_sys_0/clk] [get_bd_pins sys_ps8/maxihpm0_lpd_aclk] \
  [get_bd_pins axi_cpu_interconnect/ACLK] [get_bd_pins axi_cpu_interconnect/S00_ACLK] \
  [get_bd_pins axi_cpu_interconnect/M00_ACLK] [get_bd_pins axi_sysid_0/s_axi_aclk] [get_bd_pins axi_hp0_interconnect/aclk] \
  [get_bd_pins sys_ps8/saxihp0_fpd_aclk] [get_bd_pins util_adrv9009_xcvr/up_clk] [get_bd_pins axi_cpu_interconnect/M01_ACLK] \
  [get_bd_pins rx_adrv9009_tpl_core/s_axi_aclk] [get_bd_pins axi_cpu_interconnect/M02_ACLK] \
  [get_bd_pins tx_adrv9009_tpl_core/s_axi_aclk] [get_bd_pins axi_cpu_interconnect/M03_ACLK] \
  [get_bd_pins rx_os_adrv9009_tpl_core/s_axi_aclk] [get_bd_pins axi_cpu_interconnect/M04_ACLK] \
  [get_bd_pins axi_adrv9009_tx_xcvr/s_axi_aclk] [get_bd_pins axi_cpu_interconnect/M05_ACLK] \
  [get_bd_pins axi_adrv9009_tx_clkgen/s_axi_aclk] [get_bd_pins axi_cpu_interconnect/M06_ACLK] \
  [get_bd_pins axi_adrv9009_tx_jesd/s_axi_aclk] [get_bd_pins axi_cpu_interconnect/M07_ACLK] \
  [get_bd_pins axi_adrv9009_tx_dma/s_axi_aclk] [get_bd_pins axi_cpu_interconnect/M08_ACLK] \
  [get_bd_pins axi_adrv9009_rx_xcvr/s_axi_aclk] [get_bd_pins axi_cpu_interconnect/M09_ACLK] \
  [get_bd_pins axi_adrv9009_rx_clkgen/s_axi_aclk] [get_bd_pins axi_cpu_interconnect/M10_ACLK] \
  [get_bd_pins axi_adrv9009_rx_jesd/s_axi_aclk] [get_bd_pins axi_cpu_interconnect/M11_ACLK] \
  [get_bd_pins axi_adrv9009_rx_dma/s_axi_aclk] [get_bd_pins axi_cpu_interconnect/M12_ACLK] \
  [get_bd_pins axi_adrv9009_rx_os_xcvr/s_axi_aclk] [get_bd_pins axi_cpu_interconnect/M13_ACLK] \
  [get_bd_pins axi_adrv9009_rx_os_clkgen/s_axi_aclk] [get_bd_pins axi_cpu_interconnect/M14_ACLK] \
  [get_bd_pins axi_adrv9009_rx_os_jesd/s_axi_aclk] [get_bd_pins axi_cpu_interconnect/M15_ACLK] \
  [get_bd_pins axi_adrv9009_rx_os_dma/s_axi_aclk] [get_bd_ports axi_clk] [get_bd_pins axi_cpu_interconnect/M16_ACLK] \
  [get_bd_pins axi_interconnect_0/ACLK] [get_bd_pins axi_interconnect_0/S00_ACLK] [get_bd_pins axi_interconnect_0/M00_ACLK] \
  [get_bd_pins axi_interconnect_0/M01_ACLK] [get_bd_pins axi_interconnect_0/S01_ACLK] \
  [get_bd_pins axi_interconnect_0/M02_ACLK] [get_bd_pins jtag_axi_0/aclk] [get_bd_pins axi_interconnect_0/M03_ACLK]
connect_bd_net -net sys_250m_clk [get_bd_pins sys_ps8/pl_clk1] \
  [get_bd_pins sys_250m_rstgen/slowest_sync_clk] [get_bd_pins axi_adrv9009_dacfifo/dma_clk] \
  [get_bd_pins axi_adrv9009_tx_dma/m_axis_aclk] [get_bd_pins axi_hp1_interconnect/aclk] \
  [get_bd_pins sys_ps8/saxihp1_fpd_aclk] [get_bd_pins axi_adrv9009_rx_os_dma/m_dest_axi_aclk] \
  [get_bd_pins axi_hp2_interconnect/aclk] [get_bd_pins sys_ps8/saxihp2_fpd_aclk] \
  [get_bd_pins axi_adrv9009_rx_dma/m_dest_axi_aclk] [get_bd_pins axi_hp3_interconnect/aclk] \
  [get_bd_pins sys_ps8/saxihp3_fpd_aclk] [get_bd_pins axi_adrv9009_tx_dma/m_src_axi_aclk]
connect_bd_net -net sys_500m_clk [get_bd_pins sys_ps8/pl_clk2] [get_bd_pins sys_500m_rstgen/slowest_sync_clk]
connect_bd_net [get_bd_pins sys_ps8/pl_resetn0] \
  [get_bd_pins sys_rstgen/ext_reset_in] [get_bd_pins sys_250m_rstgen/ext_reset_in] [get_bd_pins sys_500m_rstgen/ext_reset_in]
# net sys_cpu_reset has one end: sys_rstgen/peripheral_reset
connect_bd_net -net sys_cpu_resetn [get_bd_pins sys_rstgen/peripheral_aresetn] \
  [get_bd_pins axi_cpu_interconnect/ARESETN] [get_bd_pins axi_cpu_interconnect/S00_ARESETN] \
  [get_bd_pins axi_cpu_interconnect/M00_ARESETN] [get_bd_pins axi_sysid_0/s_axi_aresetn] \
  [get_bd_pins axi_hp0_interconnect/aresetn] [get_bd_pins util_adrv9009_xcvr/up_rstn] \
  [get_bd_pins adrv9009_tx_device_clk_rstgen/ext_reset_in] [get_bd_pins adrv9009_rx_device_clk_rstgen/ext_reset_in] \
  [get_bd_pins adrv9009_rx_os_device_clk_rstgen/ext_reset_in] [get_bd_pins axi_cpu_interconnect/M01_ARESETN] \
  [get_bd_pins rx_adrv9009_tpl_core/s_axi_aresetn] [get_bd_pins axi_cpu_interconnect/M02_ARESETN] \
  [get_bd_pins tx_adrv9009_tpl_core/s_axi_aresetn] [get_bd_pins axi_cpu_interconnect/M03_ARESETN] \
  [get_bd_pins rx_os_adrv9009_tpl_core/s_axi_aresetn] [get_bd_pins axi_cpu_interconnect/M04_ARESETN] \
  [get_bd_pins axi_adrv9009_tx_xcvr/s_axi_aresetn] [get_bd_pins axi_cpu_interconnect/M05_ARESETN] \
  [get_bd_pins axi_adrv9009_tx_clkgen/s_axi_aresetn] [get_bd_pins axi_cpu_interconnect/M06_ARESETN] \
  [get_bd_pins axi_adrv9009_tx_jesd/s_axi_aresetn] [get_bd_pins axi_cpu_interconnect/M07_ARESETN] \
  [get_bd_pins axi_adrv9009_tx_dma/s_axi_aresetn] [get_bd_pins axi_cpu_interconnect/M08_ARESETN] \
  [get_bd_pins axi_adrv9009_rx_xcvr/s_axi_aresetn] [get_bd_pins axi_cpu_interconnect/M09_ARESETN] \
  [get_bd_pins axi_adrv9009_rx_clkgen/s_axi_aresetn] [get_bd_pins axi_cpu_interconnect/M10_ARESETN] \
  [get_bd_pins axi_adrv9009_rx_jesd/s_axi_aresetn] [get_bd_pins axi_cpu_interconnect/M11_ARESETN] \
  [get_bd_pins axi_adrv9009_rx_dma/s_axi_aresetn] [get_bd_pins axi_cpu_interconnect/M12_ARESETN] \
  [get_bd_pins axi_adrv9009_rx_os_xcvr/s_axi_aresetn] [get_bd_pins axi_cpu_interconnect/M13_ARESETN] \
  [get_bd_pins axi_adrv9009_rx_os_clkgen/s_axi_aresetn] [get_bd_pins axi_cpu_interconnect/M14_ARESETN] \
  [get_bd_pins axi_adrv9009_rx_os_jesd/s_axi_aresetn] [get_bd_pins axi_cpu_interconnect/M15_ARESETN] \
  [get_bd_pins axi_adrv9009_rx_os_dma/s_axi_aresetn] [get_bd_ports axi_rst_n] [get_bd_pins axi_cpu_interconnect/M16_ARESETN] \
  [get_bd_pins axi_interconnect_0/ARESETN] [get_bd_pins axi_interconnect_0/S00_ARESETN] \
  [get_bd_pins axi_interconnect_0/M00_ARESETN] [get_bd_pins axi_interconnect_0/M01_ARESETN] \
  [get_bd_pins axi_interconnect_0/S01_ARESETN] [get_bd_pins axi_interconnect_0/M02_ARESETN] [get_bd_pins jtag_axi_0/aresetn] \
  [get_bd_pins axi_interconnect_0/M03_ARESETN]
connect_bd_net -net sys_250m_reset [get_bd_pins sys_250m_rstgen/peripheral_reset] [get_bd_pins axi_adrv9009_dacfifo/dma_rst]
connect_bd_net -net sys_250m_resetn [get_bd_pins sys_250m_rstgen/peripheral_aresetn] \
  [get_bd_pins axi_adrv9009_tx_dma/m_src_axi_aresetn] [get_bd_pins axi_adrv9009_rx_dma/m_dest_axi_aresetn] \
  [get_bd_pins axi_adrv9009_rx_os_dma/m_dest_axi_aresetn] [get_bd_pins axi_hp1_interconnect/aresetn] \
  [get_bd_pins axi_hp2_interconnect/aresetn] [get_bd_pins axi_hp3_interconnect/aresetn]
# net sys_500m_reset has one end: sys_500m_rstgen/peripheral_reset
# net sys_500m_resetn has one end: sys_500m_rstgen/peripheral_aresetn
connect_bd_net [get_bd_ports gpio_i] [get_bd_pins sys_ps8/emio_gpio_i]
connect_bd_net [get_bd_pins sys_ps8/emio_gpio_o] [get_bd_ports gpio_o]
connect_bd_net [get_bd_pins sys_ps8/emio_gpio_t] [get_bd_ports gpio_t]
connect_bd_net [get_bd_pins sys_ps8/emio_spi0_ss_o_n] [get_bd_pins spi0_csn_concat/In0]
connect_bd_net [get_bd_pins sys_ps8/emio_spi0_ss1_o_n] [get_bd_pins spi0_csn_concat/In1]
connect_bd_net [get_bd_pins sys_ps8/emio_spi0_ss2_o_n] [get_bd_pins spi0_csn_concat/In2]
connect_bd_net [get_bd_pins spi0_csn_concat/dout] [get_bd_ports spi0_csn]
connect_bd_net [get_bd_pins sys_ps8/emio_spi0_sclk_o] [get_bd_ports spi0_sclk]
connect_bd_net [get_bd_pins sys_ps8/emio_spi0_m_o] [get_bd_ports spi0_mosi]
connect_bd_net [get_bd_ports spi0_miso] [get_bd_pins sys_ps8/emio_spi0_m_i]
connect_bd_net [get_bd_pins VCC_1/dout] \
  [get_bd_pins sys_ps8/emio_spi0_ss_i_n] [get_bd_pins sys_ps8/emio_spi1_ss_i_n] [get_bd_pins tx_fir_interpolator/out_resetn] \
  [get_bd_pins rx_fir_decimator/out_resetn] [get_bd_pins util_adrv9009_tx_upack/s_axis_valid]
connect_bd_net [get_bd_pins GND_1/dout] \
  [get_bd_pins sys_ps8/emio_spi0_sclk_i] [get_bd_pins sys_ps8/emio_spi0_s_i] [get_bd_pins sys_ps8/emio_spi1_sclk_i] \
  [get_bd_pins sys_ps8/emio_spi1_s_i] [get_bd_pins sys_concat_intc_1/In7] [get_bd_pins sys_concat_intc_1/In6] \
  [get_bd_pins sys_concat_intc_0/In7] [get_bd_pins sys_concat_intc_0/In6] [get_bd_pins sys_concat_intc_0/In5] \
  [get_bd_pins sys_concat_intc_0/In4] [get_bd_pins sys_concat_intc_0/In3] [get_bd_pins sys_concat_intc_0/In2] \
  [get_bd_pins sys_concat_intc_0/In1] [get_bd_pins sys_concat_intc_0/In0] [get_bd_pins tx_fir_interpolator/load_config]
connect_bd_net [get_bd_pins sys_ps8/emio_spi1_ss_o_n] [get_bd_pins spi1_csn_concat/In0]
connect_bd_net [get_bd_pins sys_ps8/emio_spi1_ss1_o_n] [get_bd_pins spi1_csn_concat/In1]
connect_bd_net [get_bd_pins sys_ps8/emio_spi1_ss2_o_n] [get_bd_pins spi1_csn_concat/In2]
connect_bd_net [get_bd_pins spi1_csn_concat/dout] [get_bd_ports spi1_csn]
connect_bd_net [get_bd_pins sys_ps8/emio_spi1_sclk_o] [get_bd_ports spi1_sclk]
connect_bd_net [get_bd_pins sys_ps8/emio_spi1_m_o] [get_bd_ports spi1_mosi]
connect_bd_net [get_bd_ports spi1_miso] [get_bd_pins sys_ps8/emio_spi1_m_i]
connect_bd_net [get_bd_pins axi_sysid_0/rom_addr] [get_bd_pins rom_sys_0/rom_addr]
connect_bd_net [get_bd_pins rom_sys_0/rom_data] [get_bd_pins axi_sysid_0/sys_rom_data]
connect_bd_net [get_bd_pins sys_concat_intc_0/dout] [get_bd_pins sys_ps8/pl_ps_irq0]
connect_bd_net [get_bd_pins sys_concat_intc_1/dout] [get_bd_pins sys_ps8/pl_ps_irq1]
connect_bd_net [get_bd_pins GND_32/dout] [get_bd_pins tx_fir_interpolator/pulse_width]
connect_bd_net -net adrv9009_tx_device_clk [get_bd_pins axi_adrv9009_tx_clkgen/clk_0] \
  [get_bd_pins adrv9009_tx_device_clk_rstgen/slowest_sync_clk] [get_bd_pins util_adrv9009_xcvr/tx_clk_0] \
  [get_bd_pins util_adrv9009_xcvr/tx_clk_3] [get_bd_pins util_adrv9009_xcvr/tx_clk_2] \
  [get_bd_pins util_adrv9009_xcvr/tx_clk_1] [get_bd_pins axi_adrv9009_tx_jesd/device_clk] \
  [get_bd_pins tx_adrv9009_tpl_core/link_clk] [get_bd_pins util_adrv9009_tx_upack/clk] [get_bd_pins tx_fir_interpolator/aclk] \
  [get_bd_pins axi_adrv9009_dacfifo/dac_clk]
connect_bd_net [get_bd_pins util_adrv9009_xcvr/tx_0_p] [get_bd_ports tx_data_0_p]
connect_bd_net [get_bd_pins util_adrv9009_xcvr/tx_0_n] [get_bd_ports tx_data_0_n]
connect_bd_net [get_bd_pins util_adrv9009_xcvr/tx_1_p] [get_bd_ports tx_data_1_p]
connect_bd_net [get_bd_pins util_adrv9009_xcvr/tx_1_n] [get_bd_ports tx_data_1_n]
connect_bd_net [get_bd_pins util_adrv9009_xcvr/tx_2_p] [get_bd_ports tx_data_2_p]
connect_bd_net [get_bd_pins util_adrv9009_xcvr/tx_2_n] [get_bd_ports tx_data_2_n]
connect_bd_net [get_bd_pins util_adrv9009_xcvr/tx_3_p] [get_bd_ports tx_data_3_p]
connect_bd_net [get_bd_pins util_adrv9009_xcvr/tx_3_n] [get_bd_ports tx_data_3_n]
connect_bd_net -net sysref_1 [get_bd_ports tx_sysref_0] [get_bd_pins axi_adrv9009_tx_jesd/sysref]
connect_bd_net -net sync_1 [get_bd_ports tx_sync_0] [get_bd_pins axi_adrv9009_tx_jesd/sync]
connect_bd_net [get_bd_pins util_adrv9009_xcvr/tx_out_clk_0] [get_bd_pins axi_adrv9009_tx_clkgen/clk]
connect_bd_net -net tx_ref_clk_0_1 [get_bd_ports tx_ref_clk_0] [get_bd_pins util_adrv9009_xcvr/qpll_ref_clk_0]
connect_bd_net [get_bd_pins axi_adrv9009_tx_xcvr/up_pll_rst] [get_bd_pins util_adrv9009_xcvr/up_qpll_rst_0]
connect_bd_net -net adrv9009_rx_device_clk [get_bd_pins axi_adrv9009_rx_clkgen/clk_0] \
  [get_bd_pins adrv9009_rx_device_clk_rstgen/slowest_sync_clk] [get_bd_pins util_adrv9009_xcvr/rx_clk_0] \
  [get_bd_pins util_adrv9009_xcvr/rx_clk_1] [get_bd_pins axi_adrv9009_rx_jesd/device_clk] \
  [get_bd_pins rx_adrv9009_tpl_core/link_clk] [get_bd_pins util_adrv9009_rx_cpack/clk] [get_bd_pins rx_fir_decimator/aclk] \
  [get_bd_pins axi_adrv9009_rx_dma/fifo_wr_clk]
connect_bd_net [get_bd_pins axi_adrv9009_rx_jesd/phy_en_char_align] \
  [get_bd_pins util_adrv9009_xcvr/rx_calign_0] [get_bd_pins util_adrv9009_xcvr/rx_calign_1]
connect_bd_net [get_bd_ports rx_data_0_p] [get_bd_pins util_adrv9009_xcvr/rx_0_p]
connect_bd_net [get_bd_ports rx_data_0_n] [get_bd_pins util_adrv9009_xcvr/rx_0_n]
connect_bd_net [get_bd_ports rx_data_1_p] [get_bd_pins util_adrv9009_xcvr/rx_1_p]
connect_bd_net [get_bd_ports rx_data_1_n] [get_bd_pins util_adrv9009_xcvr/rx_1_n]
connect_bd_net -net sysref_2 [get_bd_ports rx_sysref_0] [get_bd_pins axi_adrv9009_rx_jesd/sysref]
connect_bd_net [get_bd_pins axi_adrv9009_rx_jesd/sync] [get_bd_ports rx_sync_0]
connect_bd_net [get_bd_pins util_adrv9009_xcvr/rx_out_clk_0] [get_bd_pins axi_adrv9009_rx_clkgen/clk]
connect_bd_net -net rx_ref_clk_0_1 [get_bd_ports rx_ref_clk_0] \
  [get_bd_pins util_adrv9009_xcvr/cpll_ref_clk_0] [get_bd_pins util_adrv9009_xcvr/cpll_ref_clk_1]
connect_bd_net [get_bd_pins axi_adrv9009_rx_xcvr/up_pll_rst] \
  [get_bd_pins util_adrv9009_xcvr/up_cpll_rst_0] [get_bd_pins util_adrv9009_xcvr/up_cpll_rst_1]
connect_bd_net -net adrv9009_rx_os_device_clk [get_bd_pins axi_adrv9009_rx_os_clkgen/clk_0] \
  [get_bd_pins adrv9009_rx_os_device_clk_rstgen/slowest_sync_clk] [get_bd_pins util_adrv9009_xcvr/rx_clk_2] \
  [get_bd_pins util_adrv9009_xcvr/rx_clk_3] [get_bd_pins axi_adrv9009_rx_os_jesd/device_clk] \
  [get_bd_pins rx_os_adrv9009_tpl_core/link_clk] [get_bd_pins util_adrv9009_rx_os_cpack/clk] \
  [get_bd_pins axi_adrv9009_rx_os_dma/fifo_wr_clk]
connect_bd_net [get_bd_pins axi_adrv9009_rx_os_jesd/phy_en_char_align] \
  [get_bd_pins util_adrv9009_xcvr/rx_calign_2] [get_bd_pins util_adrv9009_xcvr/rx_calign_3]
connect_bd_net [get_bd_ports rx_data_2_p] [get_bd_pins util_adrv9009_xcvr/rx_2_p]
connect_bd_net [get_bd_ports rx_data_2_n] [get_bd_pins util_adrv9009_xcvr/rx_2_n]
connect_bd_net [get_bd_ports rx_data_3_p] [get_bd_pins util_adrv9009_xcvr/rx_3_p]
connect_bd_net [get_bd_ports rx_data_3_n] [get_bd_pins util_adrv9009_xcvr/rx_3_n]
connect_bd_net -net sysref_3 [get_bd_ports rx_sysref_2] [get_bd_pins axi_adrv9009_rx_os_jesd/sysref]
connect_bd_net [get_bd_pins axi_adrv9009_rx_os_jesd/sync] [get_bd_ports rx_sync_2]
connect_bd_net [get_bd_pins util_adrv9009_xcvr/rx_out_clk_2] [get_bd_pins axi_adrv9009_rx_os_clkgen/clk]
connect_bd_net -net rx_ref_clk_2_1 [get_bd_ports rx_ref_clk_2] \
  [get_bd_pins util_adrv9009_xcvr/cpll_ref_clk_2] [get_bd_pins util_adrv9009_xcvr/cpll_ref_clk_3]
connect_bd_net [get_bd_pins axi_adrv9009_rx_os_xcvr/up_pll_rst] \
  [get_bd_pins util_adrv9009_xcvr/up_cpll_rst_2] [get_bd_pins util_adrv9009_xcvr/up_cpll_rst_3]
connect_bd_net [get_bd_pins adrv9009_tx_device_clk_rstgen/peripheral_reset] \
  [get_bd_pins util_adrv9009_tx_upack/reset] [get_bd_pins axi_adrv9009_dacfifo/dac_rst]
connect_bd_net [get_bd_pins tx_fir_interpolator/valid_out_0] [get_bd_pins logic_or/Op1]
connect_bd_net [get_bd_pins tx_fir_interpolator/valid_out_2] [get_bd_pins logic_or/Op2]
connect_bd_net [get_bd_pins logic_or/Res] [get_bd_pins util_adrv9009_tx_upack/fifo_rd_en]
connect_bd_net [get_bd_pins tx_adrv9009_tpl_core/dac_enable_0] [get_bd_pins tx_fir_interpolator/dac_enable_0]
connect_bd_net [get_bd_pins tx_adrv9009_tpl_core/dac_valid_0] [get_bd_pins tx_fir_interpolator/dac_valid_0]
connect_bd_net [get_bd_pins util_adrv9009_tx_upack/fifo_rd_data_0] [get_bd_pins tx_fir_interpolator/data_in_0]
connect_bd_net [get_bd_pins tx_fir_interpolator/enable_out_0] [get_bd_pins util_adrv9009_tx_upack/enable_0]
connect_bd_net [get_bd_pins tx_fir_interpolator/data_out_0] [get_bd_pins tx_adrv9009_tpl_core/dac_data_0]
connect_bd_net [get_bd_pins tx_adrv9009_tpl_core/dac_enable_1] [get_bd_pins tx_fir_interpolator/dac_enable_1]
connect_bd_net [get_bd_pins tx_adrv9009_tpl_core/dac_valid_1] [get_bd_pins tx_fir_interpolator/dac_valid_1]
connect_bd_net [get_bd_pins util_adrv9009_tx_upack/fifo_rd_data_1] [get_bd_pins tx_fir_interpolator/data_in_1]
connect_bd_net [get_bd_pins tx_fir_interpolator/enable_out_1] [get_bd_pins util_adrv9009_tx_upack/enable_1]
connect_bd_net [get_bd_pins tx_fir_interpolator/data_out_1] [get_bd_pins tx_adrv9009_tpl_core/dac_data_1]
connect_bd_net [get_bd_pins tx_adrv9009_tpl_core/dac_enable_2] [get_bd_pins tx_fir_interpolator/dac_enable_2]
connect_bd_net [get_bd_pins tx_adrv9009_tpl_core/dac_valid_2] [get_bd_pins tx_fir_interpolator/dac_valid_2]
connect_bd_net [get_bd_pins util_adrv9009_tx_upack/fifo_rd_data_2] [get_bd_pins tx_fir_interpolator/data_in_2]
connect_bd_net [get_bd_pins tx_fir_interpolator/enable_out_2] [get_bd_pins util_adrv9009_tx_upack/enable_2]
connect_bd_net [get_bd_pins tx_fir_interpolator/data_out_2] [get_bd_pins tx_adrv9009_tpl_core/dac_data_2]
connect_bd_net [get_bd_pins tx_adrv9009_tpl_core/dac_enable_3] [get_bd_pins tx_fir_interpolator/dac_enable_3]
connect_bd_net [get_bd_pins tx_adrv9009_tpl_core/dac_valid_3] [get_bd_pins tx_fir_interpolator/dac_valid_3]
connect_bd_net [get_bd_pins util_adrv9009_tx_upack/fifo_rd_data_3] [get_bd_pins tx_fir_interpolator/data_in_3]
connect_bd_net [get_bd_pins tx_fir_interpolator/enable_out_3] [get_bd_pins util_adrv9009_tx_upack/enable_3]
connect_bd_net [get_bd_pins tx_fir_interpolator/data_out_3] [get_bd_pins tx_adrv9009_tpl_core/dac_data_3]
connect_bd_net -net active_1 [get_bd_ports dac_fir_filter_active] [get_bd_pins tx_fir_interpolator/active]
connect_bd_net [get_bd_pins util_adrv9009_tx_upack/s_axis_ready] [get_bd_pins axi_adrv9009_dacfifo/dac_valid]
connect_bd_net [get_bd_pins axi_adrv9009_dacfifo/dac_data] [get_bd_pins util_adrv9009_tx_upack/s_axis_data]
connect_bd_net [get_bd_pins axi_adrv9009_tx_dma/m_axis_valid] [get_bd_pins axi_adrv9009_dacfifo/dma_valid]
connect_bd_net [get_bd_pins axi_adrv9009_tx_dma/m_axis_data] [get_bd_pins axi_adrv9009_dacfifo/dma_data]
connect_bd_net [get_bd_pins axi_adrv9009_dacfifo/dma_ready] [get_bd_pins axi_adrv9009_tx_dma/m_axis_ready]
connect_bd_net [get_bd_pins axi_adrv9009_tx_dma/m_axis_xfer_req] [get_bd_pins axi_adrv9009_dacfifo/dma_xfer_req]
connect_bd_net [get_bd_pins axi_adrv9009_tx_dma/m_axis_last] [get_bd_pins axi_adrv9009_dacfifo/dma_xfer_last]
connect_bd_net [get_bd_pins axi_adrv9009_dacfifo/dac_dunf] [get_bd_pins tx_adrv9009_tpl_core/dac_dunf]
connect_bd_net [get_bd_ports dac_fifo_bypass] [get_bd_pins axi_adrv9009_dacfifo/bypass]
connect_bd_net [get_bd_pins axi_adrv9009_rx_jesd/rx_sof] [get_bd_pins rx_adrv9009_tpl_core/link_sof]
connect_bd_net [get_bd_pins axi_adrv9009_rx_jesd/rx_data_tdata] [get_bd_pins rx_adrv9009_tpl_core/link_data]
connect_bd_net [get_bd_pins axi_adrv9009_rx_jesd/rx_data_tvalid] [get_bd_pins rx_adrv9009_tpl_core/link_valid]
connect_bd_net [get_bd_pins adrv9009_rx_device_clk_rstgen/peripheral_reset] [get_bd_pins util_adrv9009_rx_cpack/reset]
connect_bd_net [get_bd_pins rx_adrv9009_tpl_core/adc_valid_0] [get_bd_pins rx_fir_decimator/valid_in_0]
connect_bd_net [get_bd_pins rx_adrv9009_tpl_core/adc_enable_0] [get_bd_pins rx_fir_decimator/enable_in_0]
connect_bd_net [get_bd_pins rx_adrv9009_tpl_core/adc_data_0] [get_bd_pins rx_fir_decimator/data_in_0]
connect_bd_net [get_bd_pins rx_fir_decimator/enable_out_0] [get_bd_pins util_adrv9009_rx_cpack/enable_0]
connect_bd_net [get_bd_pins rx_fir_decimator/data_out_0] [get_bd_pins util_adrv9009_rx_cpack/fifo_wr_data_0]
connect_bd_net [get_bd_pins rx_adrv9009_tpl_core/adc_valid_1] [get_bd_pins rx_fir_decimator/valid_in_1]
connect_bd_net [get_bd_pins rx_adrv9009_tpl_core/adc_enable_1] [get_bd_pins rx_fir_decimator/enable_in_1]
connect_bd_net [get_bd_pins rx_adrv9009_tpl_core/adc_data_1] [get_bd_pins rx_fir_decimator/data_in_1]
connect_bd_net [get_bd_pins rx_fir_decimator/enable_out_1] [get_bd_pins util_adrv9009_rx_cpack/enable_1]
connect_bd_net [get_bd_pins rx_fir_decimator/data_out_1] [get_bd_pins util_adrv9009_rx_cpack/fifo_wr_data_1]
connect_bd_net [get_bd_pins rx_adrv9009_tpl_core/adc_valid_2] [get_bd_pins rx_fir_decimator/valid_in_2]
connect_bd_net [get_bd_pins rx_adrv9009_tpl_core/adc_enable_2] [get_bd_pins rx_fir_decimator/enable_in_2]
connect_bd_net [get_bd_pins rx_adrv9009_tpl_core/adc_data_2] [get_bd_pins rx_fir_decimator/data_in_2]
connect_bd_net [get_bd_pins rx_fir_decimator/enable_out_2] [get_bd_pins util_adrv9009_rx_cpack/enable_2]
connect_bd_net [get_bd_pins rx_fir_decimator/data_out_2] [get_bd_pins util_adrv9009_rx_cpack/fifo_wr_data_2]
connect_bd_net [get_bd_pins rx_adrv9009_tpl_core/adc_valid_3] [get_bd_pins rx_fir_decimator/valid_in_3]
connect_bd_net [get_bd_pins rx_adrv9009_tpl_core/adc_enable_3] [get_bd_pins rx_fir_decimator/enable_in_3]
connect_bd_net [get_bd_pins rx_adrv9009_tpl_core/adc_data_3] [get_bd_pins rx_fir_decimator/data_in_3]
